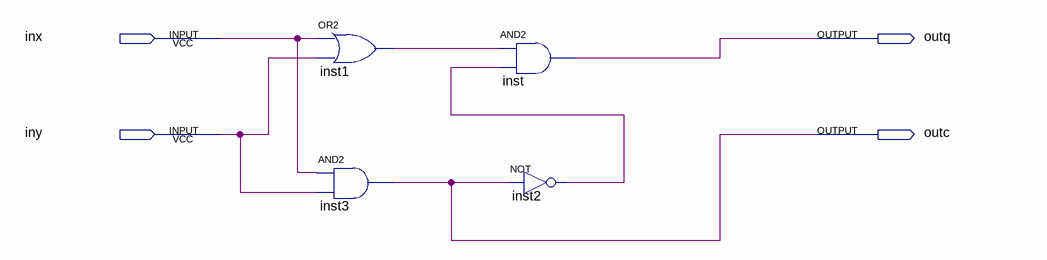
[diagram p0: schematic sheet]
// Quartus schematic sm1.bdf as structural Verilog: 4 symbols, 4 pins
module sm1 (
  input  inx,
  input  iny,
  output outq,
  output outc
);

  wire inst1_out, inst2_out;

  or inst1 (inst1_out, inx, iny);
  and inst3 (outc, inx, iny);
  and inst (outq, inst1_out, inst2_out);
  not inst2 (inst2_out, outc);
endmodule
